# EAGLE design rw-directish-17mm-mk-1.0 (EAGLE 7.5.0)
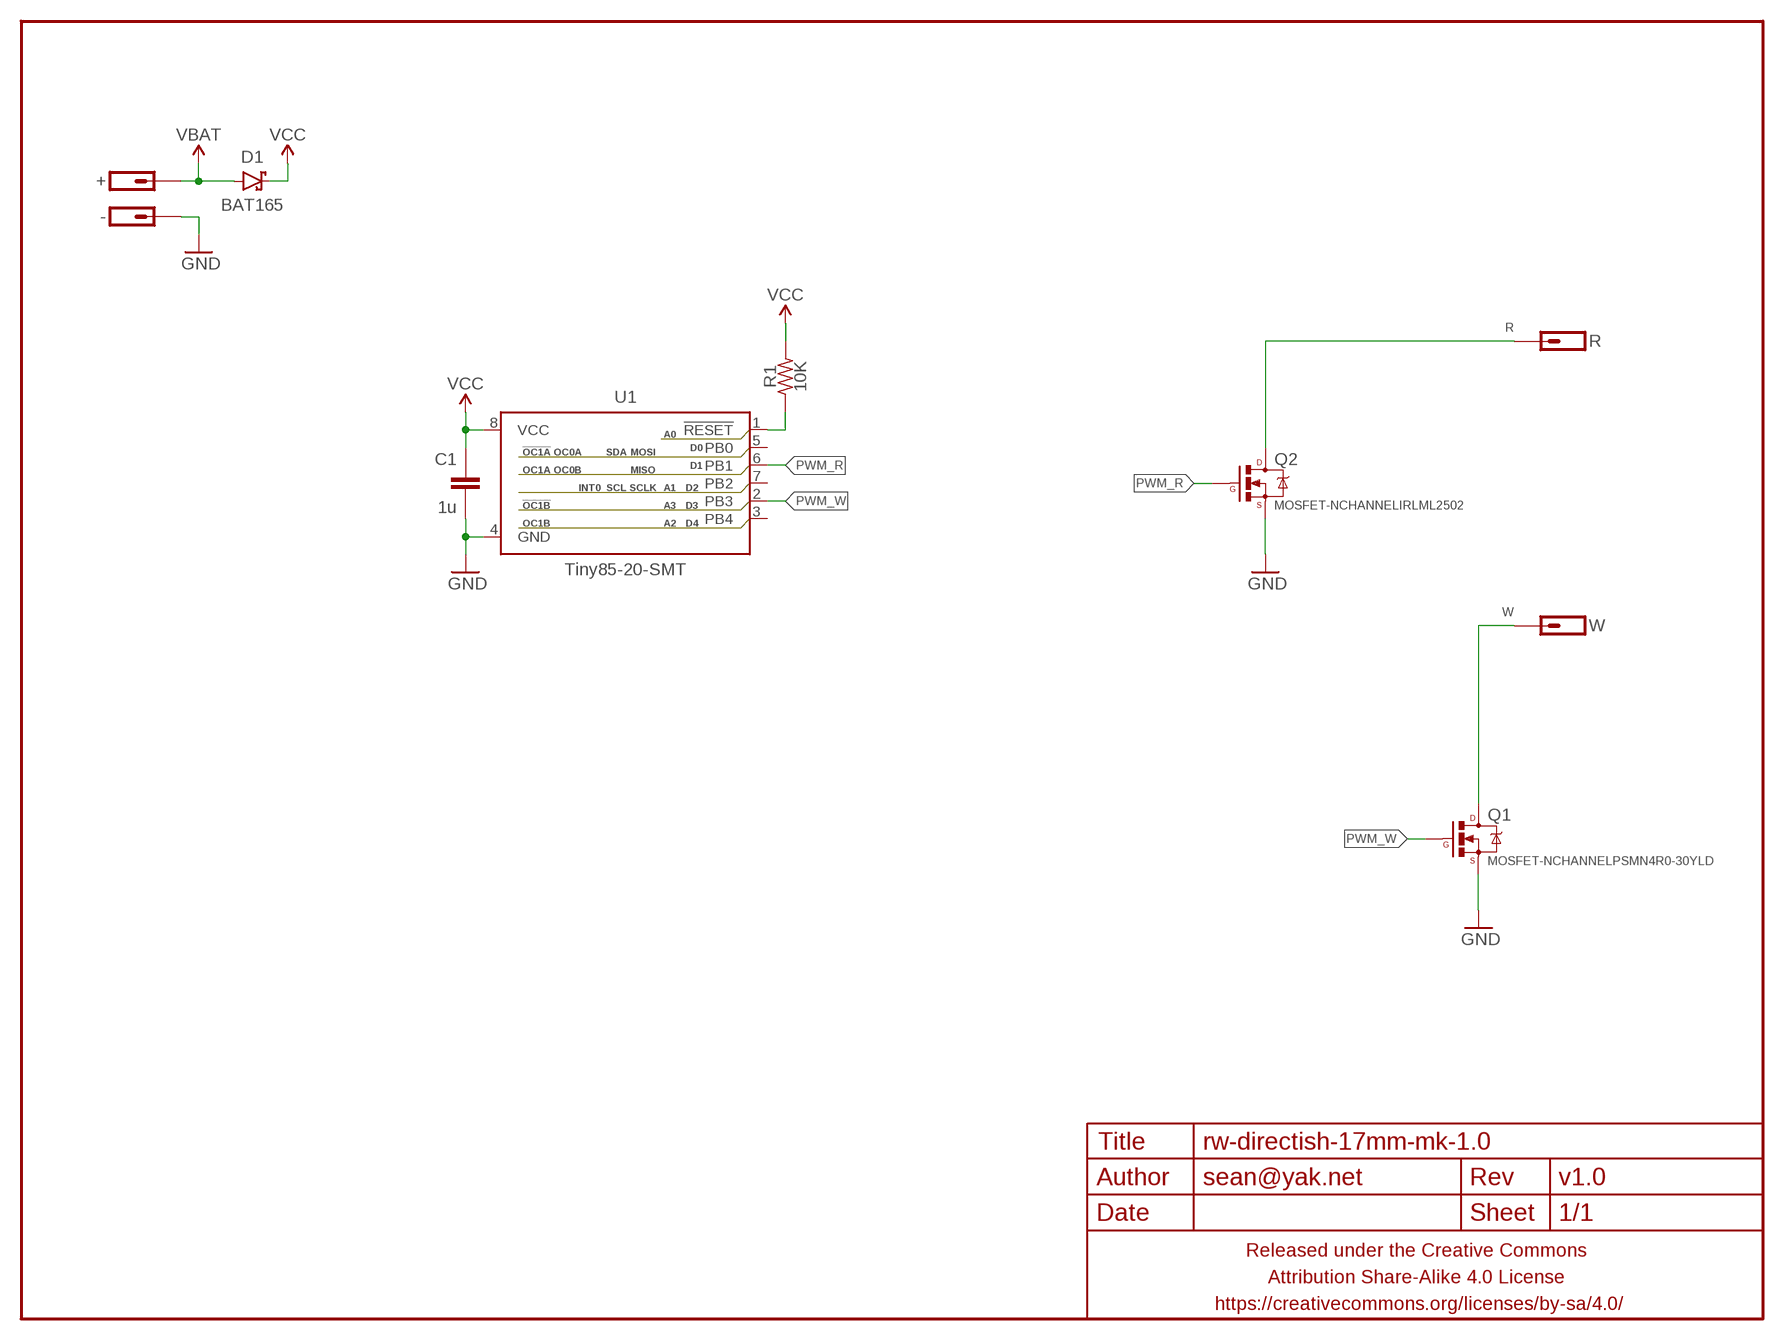
[diagram p0: schematic, sheet 1]

## Parts
+  M01PTH-1.2MM-NS  [1X01-1.2MM-NS]
-  M01NOT-A-VIA-NOPE  [1X01_NOSILK_NOSTOP]
C1  1u  CAPACITOR-CERAMICC0402  [C0402]
D1  BAT165  DIODE-SCHOTTKYSOD323  [SOD323-SCHOTTKY]
FRAME1  FRAME-LETTERNO_PACKAGE  [DUMMY]
Q1  MOSFET-NCHANNELPSMN4R0-30YLD  [LFPAK56]
Q2  MOSFET-NCHANNELIRLML2502  [SOT23]
R  M01SMD-1.25MM-DIA  [1X01-SMD-1.25MM-DIA-NS]
R1  10K  RESISTORR0402  [R0402]
U1  Tiny85-20-SMT  ATTINY45TINY85-20-SOICW  [SO08-EIAJ]
W  M01SMD-1.25MM-DIA  [1X01-SMD-1.25MM-DIA-NS]

## Nets
GND: -.P$1 C1.2 Q1.1(S) Q1.2(S) Q1.3(S) Q2.2(S) U1.4(GND)
N$4: R1.1 U1.1(!RESET)
PWM_R: Q2.1(G) U1.6(PB1)
PWM_W: Q1.4(G) U1.2(PB3)
R: Q2.3(D) R.P$1
VBAT: +.P$1 D1.A
VCC: C1.1 D1.C R1.2 U1.8(VCC)
W: Q1.MB@1(D) Q1.MB@2(D) W.P$1
Unconnected: U1.3(PB4) U1.5(PB0) U1.7(PB2)

## Library data of the parts
+ - R W = a_parts:M01: Header 1 Standard 1-pin 0.1" header. Use with straight break away headers (SKU : PRT-00116), right angle break away headers (PRT-00553), swiss pins (PRT-00743), machine pins (PRT-00117), and female headers (PRT-00115).
C1 = a_parts:CAPACITOR-CERAMIC: CAPACITOR, European symbol
D1 = a_parts:DIODE-SCHOTTKY: Schottky diodes in SFE's production catalog BAT20J 1A 23V 0.62Vf RB751 120mA 40V 0.37Vf PMEG4005EJ 0.5A 40V 0.42Vf MBRA140 1A 40V 0.5Vf B340A 3A 40V SMA
FRAME1 = a_parts:FRAME-LETTER: Schematic Frame Standard 8.5x11 US Letter frame; DESIGNER: sean@yak.net; VERSION: v1.0
Q1 Q2 = a_parts:MOSFET-NCHANNEL: Common NMOSFET Parts MFG P/N Store ID Prod ID FDD8780 TRANS-09984 SI7820DN TRANS-11055 FDS6630A IC-08089 2N7002PW TRANS-11151 FQP30N06L COM-10213 TRANS-10060 BSS123LT1G TRANS-08345 BSS138 TRANS-00830 BS170 2N7000
R1 = a_parts:RESISTOR: RESISTOR, American symbol
U1 = a_parts:ATTINY45: Atmel 8-pin 2/4/8kB flash uC; PROD_ID: IC-09092

## Board
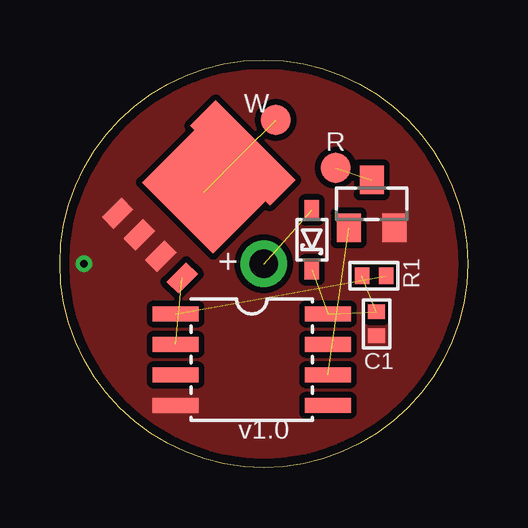
[diagram p1: board, top side]
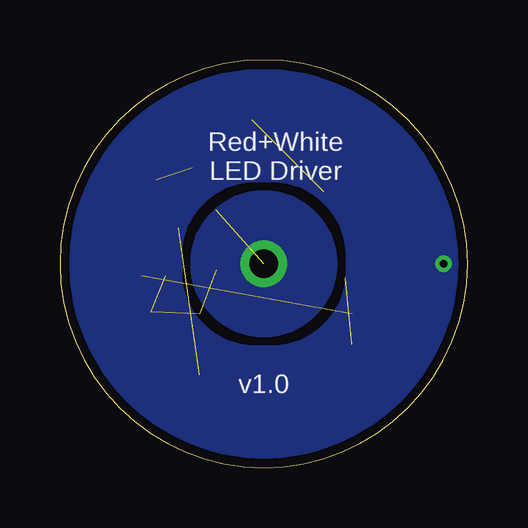
[diagram p2: board, bottom side, seen from below]

Size 17 x 17 mm. Coordinates in mm from the lower left corner, seen from the top.
Outline: 0,8.5 arc-180 17,8.5 arc-180 0,8.5
Copper layers (1*16): Top 0.0356mm / dielectric 1.5011mm / Bottom 0.0356mm
Design rules "LaenPCBOrder2": minimum track width 6mil, minimum drill 13mil, track to track 6mil, track to pad 6mil, pad to pad 6mil, via to via 6mil, smd to smd 6mil, copper to edge 15mil, drill to drill 6mil, minimum pad ring 7mil, minimum via ring 7mil, stop-mask expansion 3mil, vias tented up to drill 20mil, thermal gap 10mil

### Footprints (pad centres in the part's own frame; a part is rotated, then mirrored left to right if it is on the bottom)
1X01-1.2MM-NS = drill 1.2 pad 1.93: P$1 0,0
1X01_NOSILK_NOSTOP = drill 0.33: P$1 0,0
C0402 = smd 0.6 x 0.7: 1 -0.5,0; 2 0.5,0
SOD323-SCHOTTKY = smd 0.8 x 0.6: A -1.25,0; C 1.25,0
LFPAK56 = smd 0.7 x 1.15: 1 -1.905,-3.175; 2 -0.635,-3.175; 3 0.635,-3.175; 4 1.905,-3.175 | smd 4.2 x 3.1: MB@1 0,0 | smd 4.7 x 1.5: MB@2 0,2.3
SOT23 = smd 1 x 1.2: 1 -0.95,-1; 2 0.95,-1; 3 0,1
1X01-SMD-1.25MM-DIA-NS = smd 1.25 x 1.25: P$1 0,0
R0402 = smd 0.6 x 0.7: 1 -0.5,0; 2 0.5,0
SO08-EIAJ = smd 0.61 x 1.905: 1 -1.905,-3.175; 2 -0.635,-3.175; 3 0.635,-3.175; 4 1.905,-3.175; 5 1.905,3.175; 6 0.635,3.175; 7 -0.635,3.175; 8 -1.905,3.175

### Placement (x,y rotation side)
+  8.5,8.5 90 top
-  1,8.5 90 bottom
C1  13.2,6 270 top
D1  10.5,9.5 270 top
FRAME1  0,0 0 top
Q1  6,11.5 315 top
Q2  13,11 0 top
R  11.5,12.5 0 top
R1  13.1,8 180 top
U1  8,4.5 270 top
W  9,14.5 270 top

### Tracks (layer width: path | path; a pad name or v marks a point on that pad's centre or on a via)
GND
  pour Top (isolate 0.25, rank 6, no thermals): 0,0 17,0 17,17 0,17
  pour Bottom (isolate 0.35, rank 6, no thermals): 0,0 0,17 17,17 17,0
N$4  (1 unrouted)
PWM_R  (1 unrouted)
PWM_W  (1 unrouted)
R  (1 unrouted)
VBAT  (1 unrouted)
  pour Bottom (isolate 0.152, no thermals): 5.5,8.5 arc-180 11.5,8.5 arc-180
VCC  (3 unrouted)
W  (2 unrouted)

### Text on the board
bPlace: Red+White / LED Driver